# EAGLE design isp_breadboard_adapter_v2 (EAGLE 5.06)
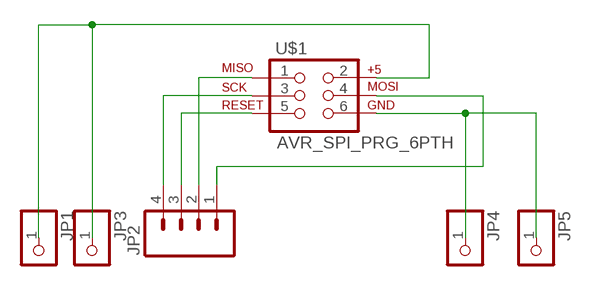
[diagram p0: schematic, sheet 1]

## Parts
JP1  PINHD-1X1  [1X01]
JP2  M04PTH  [1X04]
JP3  PINHD-1X1  [1X01]
JP4  PINHD-1X1  [1X01]
JP5  PINHD-1X1  [1X01]
U$1  AVR_SPI_PRG_6PTH  [2X3]

## Nets
+5: JP1.1 JP3.1 U$1.2
GND: JP4.1 JP5.1 U$1.6
MISO: JP2.2 U$1.1
MOSI: JP2.1 U$1.4
RESET: JP2.4 U$1.3
SCK: JP2.3 U$1.5

## Library data of the parts
JP1 JP3-JP5 = pinhead:PINHD-1X1: PIN HEADER
JP2 = SparkFun:M04: Header 4 Standard 4-pin 0.1" header. Use with straight break away headers (SKU : PRT-00116), right angle break away headers (PRT-00553), swiss pins (PRT-00743), machine pins (PRT-00117), and female headers (PRT-00115). Molex polarized connector foot print use with SKU : PRT-08231 with associated crimp pins and housings.
U$1 = SparkFun:AVR_SPI_PRG_6: AVR ISP 6 Pin This is the reduced ISP connector for AVR programming. Common on Arduino. This footprint will take up less PCB space and can be used with a 10-pin to 6-pin adapter such as SKU: BOB-08508

## Board
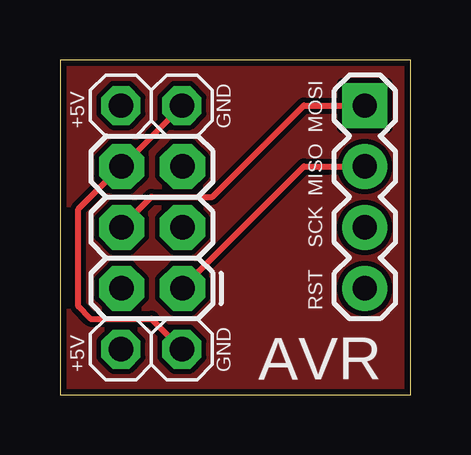
[diagram p1: board, top side]
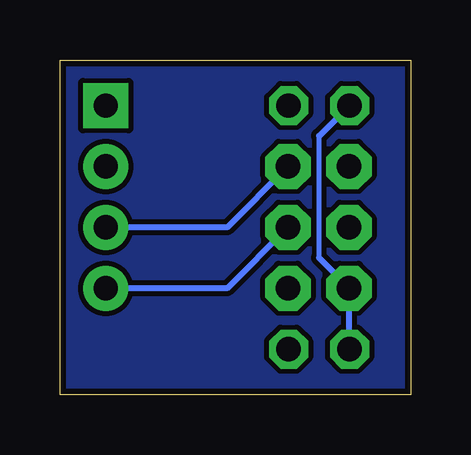
[diagram p2: board, bottom side, seen from below]

Size 14.61 x 13.97 mm. Coordinates in mm from the lower left corner, seen from the top.
Outline: 0,13.97 0,0 14.61,0 14.61,13.97 0,13.97
Copper layers (1*16): Top 0.035mm / dielectric 1.5mm / Bottom 0.035mm
Design rules "SparkFun *": minimum track width 8mil, minimum drill 20mil, track to track 8mil, track to pad 8mil, pad to pad 8mil, via to via 8mil, smd to smd 8mil, copper to edge 10mil, drill to drill 8mil, minimum pad ring 12mil, minimum via ring 10mil, stop-mask expansion 4mil, vias tented up to drill 25mil, thermal gap 0mil

### Footprints (pad centres in the part's own frame; a part is rotated, then mirrored left to right if it is on the bottom)
1X01 = drill 1.016 octagon: 1 0,0
1X04 = drill 1.016 pad 1.88 square: 1 0,0 | drill 1.016 pad 1.88 round: 2 2.54,0; 3 5.08,0; 4 7.62,0
2X3 = drill 1.016 pad 1.88 octagon: 1 0,0; 2 0,2.54; 3 2.54,0; 4 2.54,2.54; 5 5.08,0; 6 5.08,2.54

### Placement (x,y rotation side)
JP1  2.54,1.91 0 top
JP2  12.7,12.06 270 top
JP3  2.54,12.06 270 top
JP4  5.08,12.06 270 top
JP5  5.08,1.91 0 top
U$1  5.11,4.45 90 top

### Tracks (layer width: path | path; a pad name or v marks a point on that pad's centre or on a via)
+5
  Bottom 0.203: 3.81,5.71 3.81,10.79
  Bottom 0.254: 3.81,10.79 JP3.1 | 3.81,5.71 2.56,4.47 U$1.2 2.54,1.93 JP1.1
GND
  Top 0.254: JP4.1 2.56,9.5 U$1.6 2.54,9.53 0.76,7.75 0.76,3.68 1.27,3.17 3.81,3.17 JP5.1
MISO
  Top 0.254: JP2.2 10.16,9.53 5.11,4.47 U$1.1
MOSI
  Top 0.254: JP2.1 10.16,12.06 6.35,8.26 3.81,8.26 2.56,7.01 U$1.4
N$3
  pour Top: 0,0 0,13.97 14.61,13.97 14.61,0
N$4
  pour Bottom: 0,13.97 14.61,13.97 14.61,0 0,0
RESET
  Bottom 0.254: U$1.3 7.64,4.45 JP2.4
SCK
  Bottom 0.254: U$1.5 7.64,6.99 JP2.3

### Text on the board
tPlace: MOSI | +5V | GND | MISO | SCK | RST | +5V | GND | AVR